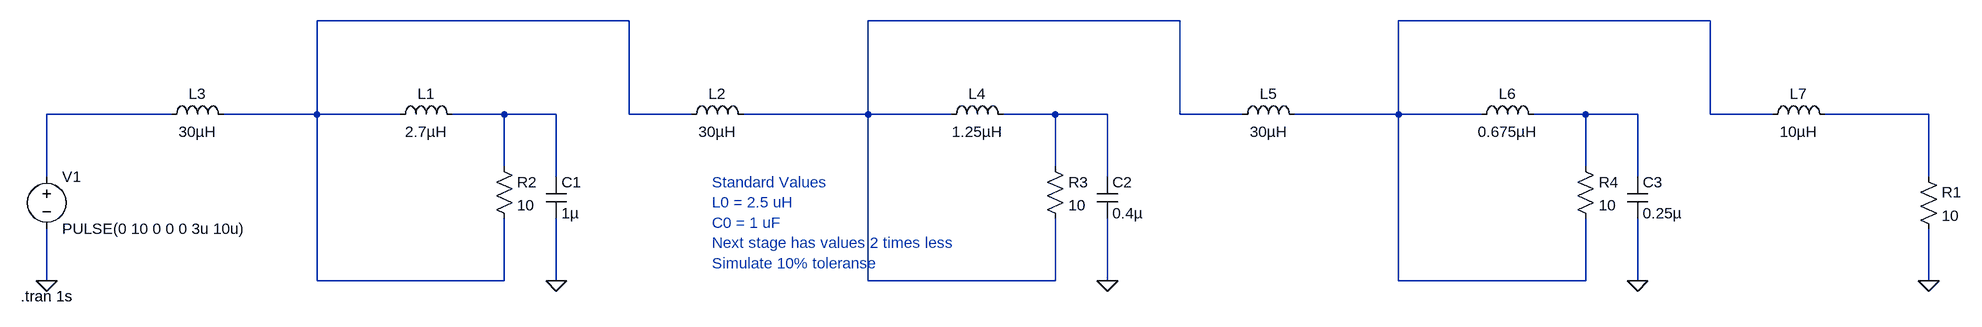
[diagram p0: schematic PWM_concept_01.asc]
PWM_concept_01.asc, the LTspice schematic file:
Version 4
SHEET 1 3368 680
WIRE 592 -112 112 -112
WIRE 1440 -112 960 -112
WIRE 2256 -112 1776 -112
WIRE -112 32 -304 32
WIRE 112 32 112 -112
WIRE 112 32 -32 32
WIRE 240 32 112 32
WIRE 400 32 320 32
WIRE 480 32 400 32
WIRE 592 32 592 -112
WIRE 688 32 592 32
WIRE 960 32 960 -112
WIRE 960 32 768 32
WIRE 1088 32 960 32
WIRE 1248 32 1168 32
WIRE 1328 32 1248 32
WIRE 1440 32 1440 -112
WIRE 1536 32 1440 32
WIRE 1776 32 1776 -112
WIRE 1776 32 1616 32
WIRE 1904 32 1776 32
WIRE 2064 32 1984 32
WIRE 2144 32 2064 32
WIRE 2256 32 2256 -112
WIRE 2352 32 2256 32
WIRE 2592 32 2432 32
WIRE 400 112 400 32
WIRE 1248 112 1248 32
WIRE 2064 112 2064 32
WIRE -304 128 -304 32
WIRE 480 128 480 32
WIRE 1328 128 1328 32
WIRE 2144 128 2144 32
WIRE 2592 128 2592 32
WIRE -304 288 -304 208
WIRE 112 288 112 32
WIRE 400 288 400 192
WIRE 400 288 112 288
WIRE 480 288 480 192
WIRE 960 288 960 32
WIRE 1248 288 1248 192
WIRE 1248 288 960 288
WIRE 1328 288 1328 192
WIRE 1776 288 1776 32
WIRE 2064 288 2064 192
WIRE 2064 288 1776 288
WIRE 2144 288 2144 192
WIRE 2592 288 2592 208
FLAG -304 288 0
FLAG 480 288 0
FLAG 2592 288 0
FLAG 1328 288 0
FLAG 2144 288 0
SYMBOL voltage -304 112 R0
WINDOW 123 0 0 Left 0
WINDOW 39 0 0 Left 0
SYMATTR InstName V1
SYMATTR Value PULSE(0 10 0 0 0 3u 10u)
SYMBOL res 2576 112 R0
SYMATTR InstName R1
SYMATTR Value 10
SYMBOL cap 464 128 R0
SYMATTR InstName C1
SYMATTR Value 1µ
SYMBOL ind 224 48 R270
WINDOW 0 32 56 VTop 2
WINDOW 3 5 56 VBottom 2
SYMATTR InstName L1
SYMATTR Value 2.7µH
SYMBOL ind 672 48 R270
WINDOW 0 32 56 VTop 2
WINDOW 3 5 56 VBottom 2
SYMATTR InstName L2
SYMATTR Value 30µH
SYMBOL ind -128 48 R270
WINDOW 0 32 56 VTop 2
WINDOW 3 5 56 VBottom 2
SYMATTR InstName L3
SYMATTR Value 30µH
SYMBOL cap 1312 128 R0
SYMATTR InstName C2
SYMATTR Value 0.4µ
SYMBOL ind 1072 48 R270
WINDOW 0 32 56 VTop 2
WINDOW 3 5 56 VBottom 2
SYMATTR InstName L4
SYMATTR Value 1.25µH
SYMBOL ind 1520 48 R270
WINDOW 0 32 56 VTop 2
WINDOW 3 5 56 VBottom 2
SYMATTR InstName L5
SYMATTR Value 30µH
SYMBOL cap 2128 128 R0
SYMATTR InstName C3
SYMATTR Value 0.25µ
SYMBOL ind 1888 48 R270
WINDOW 0 32 56 VTop 2
WINDOW 3 5 56 VBottom 2
SYMATTR InstName L6
SYMATTR Value 0.675µH
SYMBOL ind 2336 48 R270
WINDOW 0 32 56 VTop 2
WINDOW 3 5 56 VBottom 2
SYMATTR InstName L7
SYMATTR Value 10µH
SYMBOL res 384 96 R0
SYMATTR InstName R2
SYMATTR Value 10
SYMBOL res 1232 96 R0
SYMATTR InstName R3
SYMATTR Value 10
SYMBOL res 2048 96 R0
SYMATTR InstName R4
SYMATTR Value 10
TEXT -344 312 Left 2 !.tran 1s
TEXT 720 136 Left 2 ;Standard Values\nL0 = 2.5 uH\nC0 = 1 uF\nNext stage has values 2 times less\nSimulate 10% toleranse

The netlist it stands for:
* PWM_concept_01.asc
V1 N004 0 PULSE(0 10 0 0 0 3u 10u)
R1 N008 0 10
C1 N005 0 1µ
L1 N001 N005 2.7µH
L2 N001 N002 30µH
L3 N004 N001 30µH
C2 N006 0 0.4µ
L4 N002 N006 1.25µH
L5 N002 N003 30µH
C3 N007 0 0.25µ
L6 N003 N007 0.675µH
L7 N003 N008 10µH
R2 N005 N001 10
R3 N006 N002 10
R4 N007 N003 10
.tran 1s
* Standard Values
* L0 = 2.5 uH
* C0 = 1 uF
* Next stage has values 2 times less
* Simulate 10% toleranse
.backanno
.end